# Altium schematic sheet YZ85915058P-04025-011_YZ85915058P-04025-01.schdoc
size 124 x 99 mm
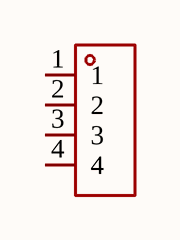
[diagram p0: YZ85915058P-04025-011_YZ85915058P-04025-01.schdoc]

## Parts
U?  YZ85915058P-04025-01  [CONN-TH_YZ85915058P-04025-01]  (value not drawn)

## Nets

Not connected (* = marked no-connect by the designer): U? 1 2 3 4

## Library data of the parts
U? = YZ85915058P-04025-01: Manufacturer: Xinyangze(鑫扬泽); Add into BOM: yes; Pitch: 2.5mm; Overall Length/Height: 5.8mm; Operational Height: 4mm; Contact Resistance: 50mΩ; Elastic Life: 10000次; Rated Current: 2A; Rated Voltage: 12V; Symbol: YZ85915058P-04025-01; Device: YZ85915058P-04025-01; LCSC Part Name: 4pin插件弹簧顶针连接器; Supplier Part: C5200681; Manufacturer Part: YZ85915058P-04025-01; Supplier Footprint: -; JLCPCB Part Class: Extended Part; Datasheet: https://atta.szlcsc.com/upload/public/pdf/source/20221019/FB85B2751BFAA71CBEA59729DDAA6C89.pdf; Supplier: LCSC; Convert to PCB: yes; Type: 弹簧顶针(POGO PIN); Number of Pins: 四PIN位; Contact Material: 黄铜; Contact Plating: 金; Operating Temperature Range: -20℃~+70℃